# EAGLE design MultiBoard (EAGLE 9.2.2)
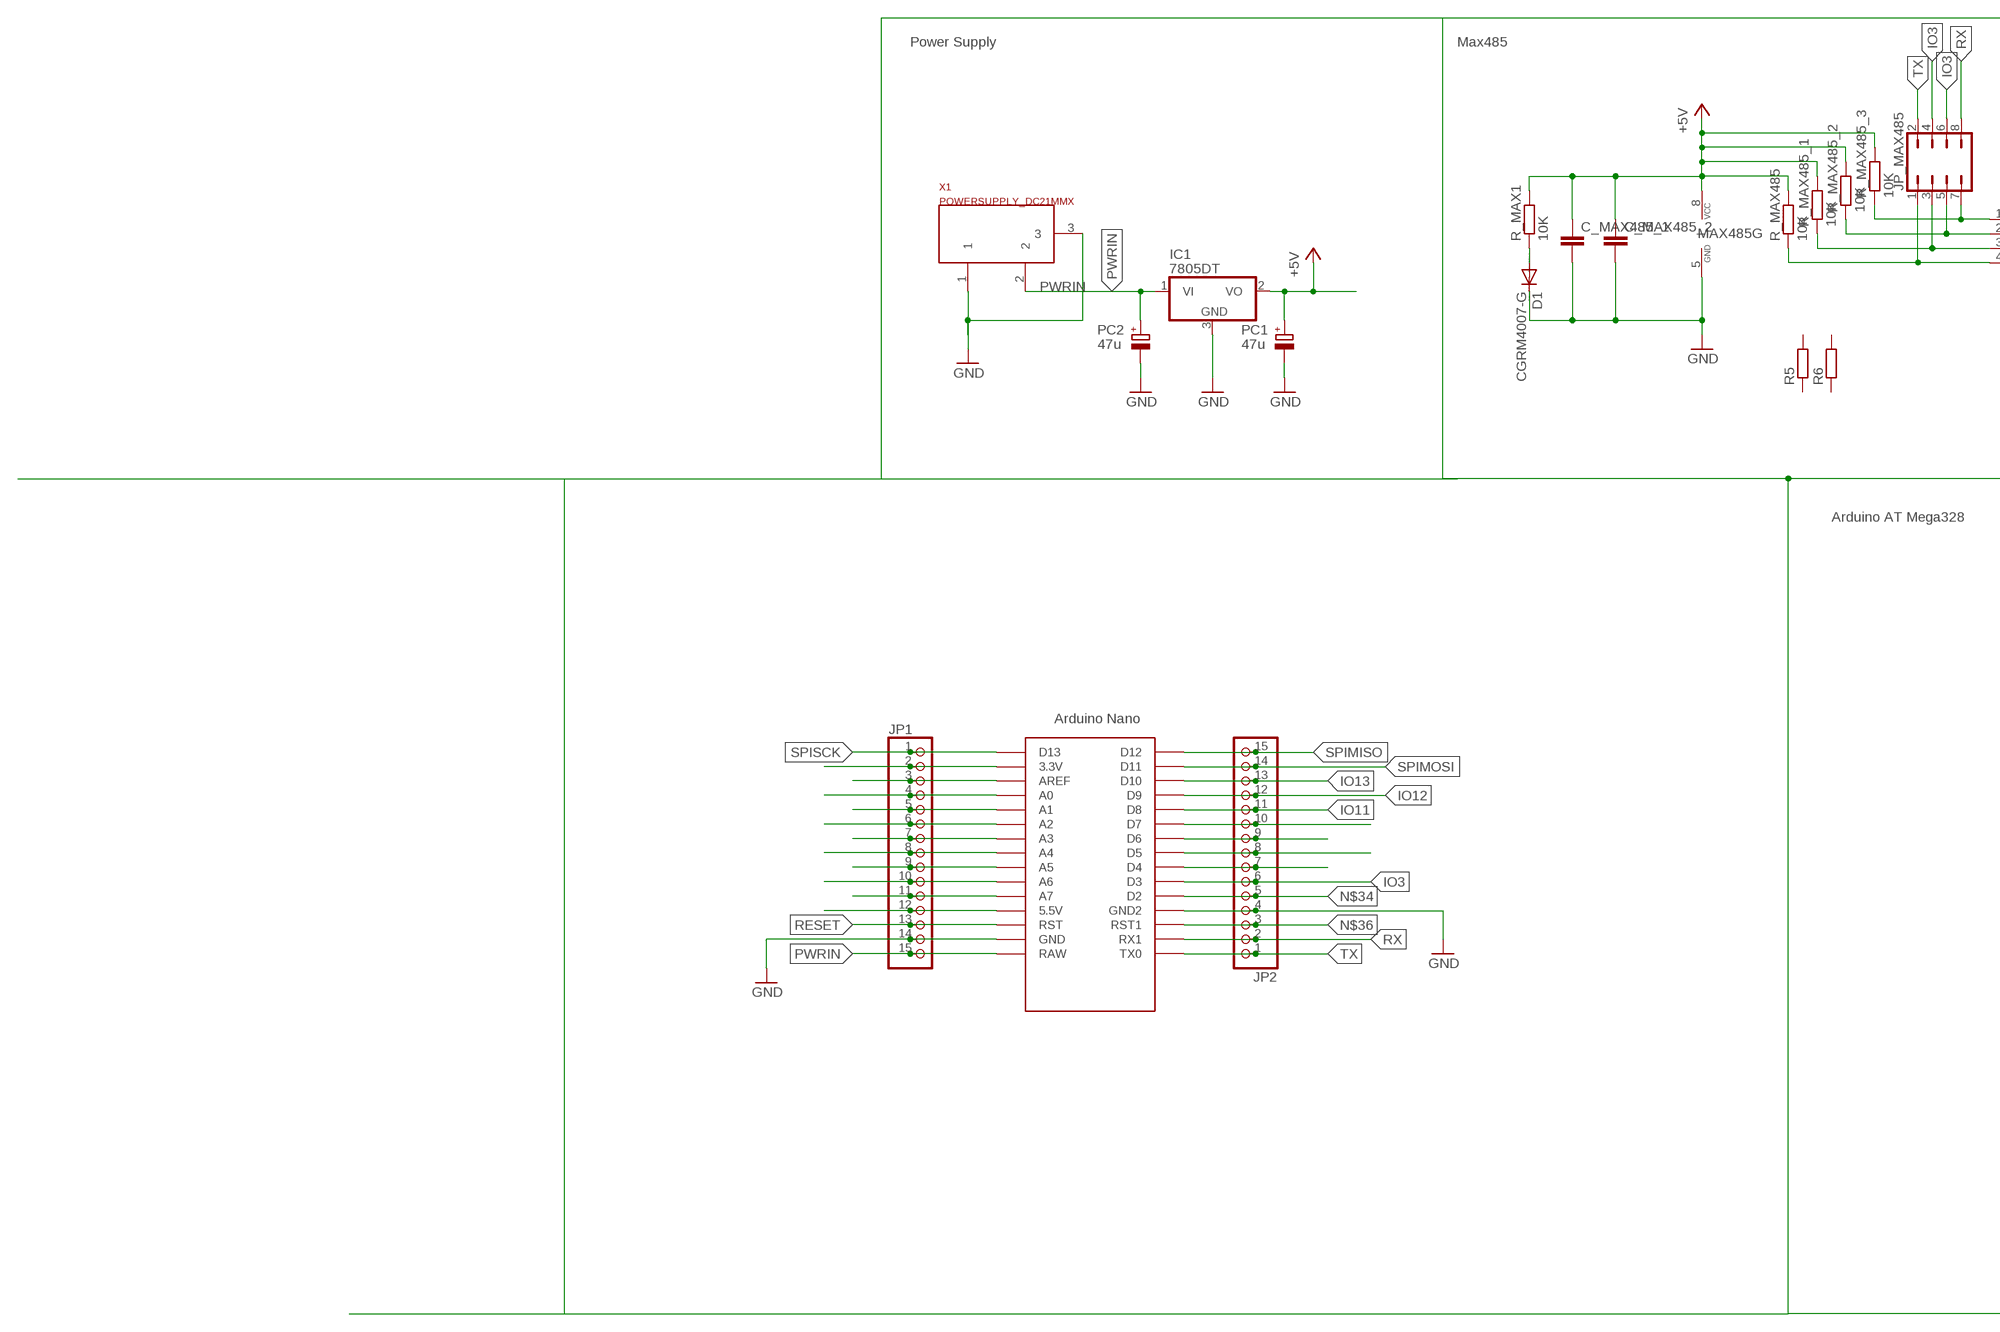
[diagram p0: schematic, sheet 1, part 1 of 2]
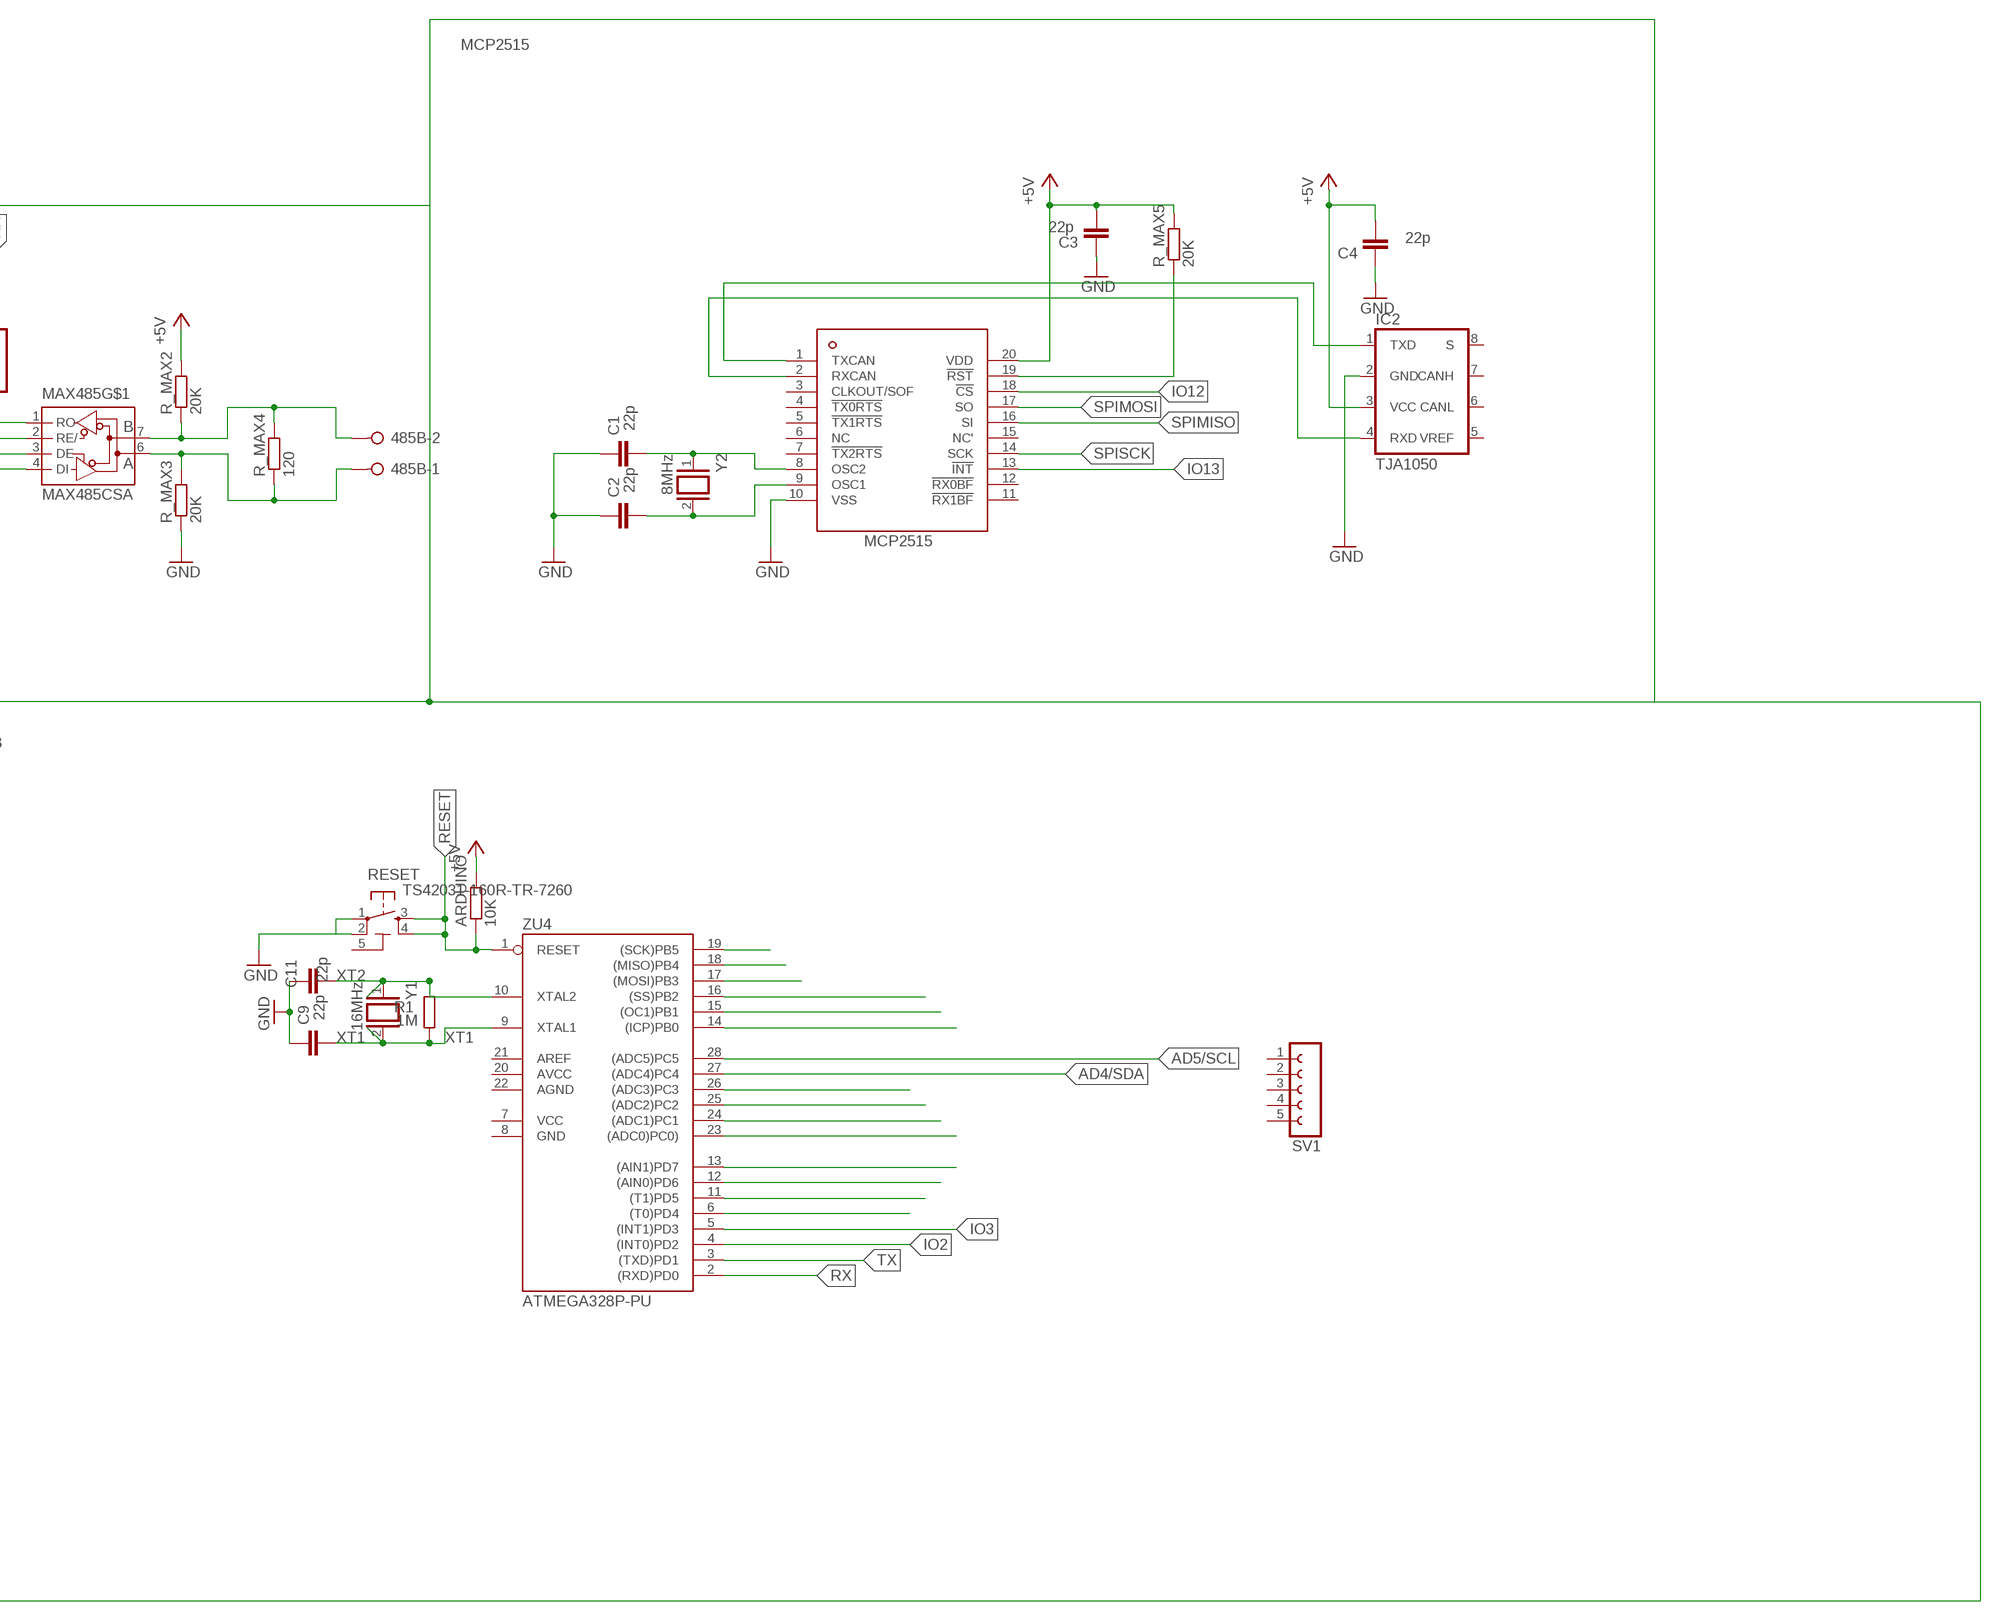
[diagram p1: schematic, sheet 1, part 2 of 2]

## Parts
485B  W237-02P  [W237-132]
ARDUINO  10K  R-EU_R0402  [R0402]
C1  22p  C-EU0603-RND  [C0603-ROUND]
C2  22p  C-EU0603-RND  [C0603-ROUND]
C3  22p  C-EU0603-RND  [C0603-ROUND]
C4  22p  C-EU0603-RND  [C0603-ROUND]
C9  22p  C-EU0603-RND  [C0603-ROUND]
C11  22p  C-EU0603-RND  [C0603-ROUND]
C_MAX485_1  C-EUC0402  [C0402]
C_MAX485_2  C-EUC0402  [C0402]
D1  CGRM4007-G  [SOD-123_MINI-SMA]
IC1  7805DT  [TO252]
IC2  TJA1050  [DIL08]
JP1  PINHD-1X15  [1X15]
JP2  PINHD-1X15  [1X15]
JP_MAX485  JP4Q  [JP4Q]
MAX485  MAX485CSA  [SO08]
PC1  47u  CPOL-EUD  [PANASONIC_D]
PC2  47u  CPOL-EUD  [PANASONIC_D]
R1  1M  R-EU_R0603  [R0603-ROUND]
R5  R-EU_M0805  [M0805]
R6  R-EU_M0805  [M0805]
R_MAX1  10K  R-EU_R0402  [R0402]
R_MAX2  20K  R-EU_R0402  [R0402]
R_MAX3  20K  R-EU_R0402  [R0402]
R_MAX4  120  R-EU_R0402  [R0402]
R_MAX5  20K  R-EU_R0402  [R0402]
R_MAX485  10K  R-EU_R0402  [R0402]
R_MAX485_1  10K  R-EU_R0402  [R0402]
R_MAX485_2  10K  R-EU_R0402  [R0402]
R_MAX485_3  10K  R-EU_R0402  [R0402]
RESET  TS42031-160R-TR-7260  TS42  [TS42]
SV1  FE05-1  [FE05-1]
U$1  NANO  [NANO]
U$2  MCP2515  [TSSOP20]
X1  POWERSUPPLY_DC21MMX  [POWERSUPPLY_DC-21MM]
Y1  16MHz  XTAL/S  [QS]
Y2  8MHz  XTAL/S  [QS]
ZU4  ATMEGA328P-PU  [DIL28-3]

## Nets
+5V: ARDUINO.2 C3.1 C4.1 C_MAX485_1.1 C_MAX485_2.1 IC1.2(VO) IC2.3(VCC) MAX485.8(G:VCC) PC1.+ R_MAX1.2 R_MAX2.2 R_MAX5.2 R_MAX485.2 R_MAX485_1.2 R_MAX485_2.2 R_MAX485_3.2 U$2.20(VDD)
AD0: ZU4.23((ADC0)PC0))
AD1: ZU4.24((ADC1)PC1)
AD2: ZU4.25((ADC2)PC2)
AD3: ZU4.26((ADC3)PC3)
AD4/SDA: ZU4.27((ADC4)PC4)
AD5/SCL: ZU4.28((ADC5)PC5)
GND: C1.2 C2.2 C3.2 C4.2 C9.2 C11.2 C_MAX485_1.2 C_MAX485_2.2 D1.C IC1.3(GND) IC2.2(GND) JP1.14 JP2.4 MAX485.5(G:GND) PC1.- PC2.- R_MAX3.1 RESET.1 RESET.2 U$1.GND U$1.GND1(GND2) U$2.10(VSS) X1.1 X1.3
IO2: ZU4.4((INT0)PD2)
IO3: JP2.6 JP_MAX485.4 JP_MAX485.6 U$1.D3 ZU4.5((INT1)PD3)
IO4: ZU4.6((T0)PD4)
IO5: ZU4.11((T1)PD5)
IO6: ZU4.12((AIN0)PD6)
IO7: ZU4.13((AIN1)PD7)
IO8: ZU4.14((ICP)PB0)
IO9: ZU4.15((OC1)PB1)
IO11: JP2.11 U$1.D8
IO12: JP2.12 U$1.D9 U$2.18(!CS)
IO13: JP2.13 U$1.D10 U$2.13(!INT)
MISO: ZU4.18((MISO)PB4)
MOSI: ZU4.17((MOSI)PB3)
N$1: JP_MAX485.7 MAX485.1(RO) R_MAX485_3.1
N$2: JP_MAX485.5 MAX485.2(RE/) R_MAX485_2.1
N$3: JP_MAX485.3 MAX485.3(DE) R_MAX485_1.1
N$4: JP_MAX485.1 MAX485.4(DI) R_MAX485.1
N$5: 485B.2 MAX485.7(B) R_MAX2.1 R_MAX4.2
N$6: D1.A R_MAX1.1
N$7: 485B.1 MAX485.6(A) R_MAX3.2 R_MAX4.1
N$10: IC2.1(TXD) U$2.1(TXCAN)
N$11: JP1.2 U$1.3.3V
N$12: JP1.3 U$1.AREF
N$13: JP1.4 U$1.A0
N$14: JP1.5 U$1.A1
N$15: JP1.6 U$1.A2
N$16: JP1.7 U$1.A3
N$17: JP1.8 U$1.A4
N$18: JP1.9 U$1.A5
N$19: JP1.10 U$1.A6
N$20: JP1.11 U$1.A7
N$21: JP1.12 U$1.5V(5.5V)
N$22: IC2.4(RXD) U$2.2(RXCAN)
N$23: R_MAX5.1 U$2.19(!RST)
N$29: JP2.10 U$1.D7
N$30: JP2.9 U$1.D6
N$31: JP2.8 U$1.D5
N$32: JP2.7 U$1.D4
N$33: C1.1 U$2.8(OSC2) Y2.1
N$34: JP2.5 U$1.D2
N$36: JP2.3 U$1.RST1
N$37: C2.1 U$2.9(OSC1) Y2.2
PWRIN [power]: IC1.1(VI) JP1.15 PC2.+ U$1.RAW X1.2
RESET: ARDUINO.1 JP1.13 RESET.3 RESET.4 U$1.RST ZU4.1(RESET)
RX: JP2.2 JP_MAX485.8 U$1.RX1 ZU4.2((RXD)PD0)
SCK: ZU4.19((SCK)PB5)
SPIMISO: JP2.15 U$1.D12 U$2.16(SI)
SPIMOSI: JP2.14 U$1.D11 U$2.17(SO)
SPISCK: JP1.1 U$1.D13 U$2.14(SCK)
SS: ZU4.16((SS)PB2)
TX: JP2.1 JP_MAX485.2 U$1.TX0 ZU4.3((TXD)PD1)
XT1: C9.1 R1.1 Y1.2 ZU4.9(XTAL1)
XT2: C11.1 R1.2 Y1.1 ZU4.10(XTAL2)
Unconnected: IC2.5(VREF) IC2.6(CANL) IC2.7(CANH) IC2.8(S) R5.1 R5.2 R6.1 R6.2 SV1.1 SV1.2 SV1.3 SV1.4 SV1.5 U$1.ICSP1 U$1.ICSP2 U$1.ICSP3 U$1.ICSP4 U$1.ICSP5 U$1.ICSP6 U$2.3(CLKOUT/SOF) U$2.4(!TX0RTS) U$2.5(!TX1RTS) U$2.6(NC) U$2.7(!TX2RTS) U$2.11(!RX1BF) U$2.12(!RX0BF) U$2.15(NC') ZU4.21(AREF)

## Notes on the sheet
- MCP2515
- Power Supply | Max485
- Arduino AT Mega328

## Power pins joined to a net without a drawn wire
5-GND: RESET.5(5-GND)
AGND: ZU4.22(AGND)
AVCC: ZU4.20(AVCC)
GND: ZU4.8(GND)
VCC: ZU4.7(VCC)

## Library data of the parts
485B = con-wago-508:W237-02P: WAGO SREW CLAMP; OC_FARNELL: unknown; OC_NEWARK: unknown
ARDUINO R5 R6 R_MAX1-R_MAX5 R_MAX485 R_MAX485_1-R_MAX485_3 = rcl:R-EU_: RESISTOR, European symbol; SPICEPREFIX: R
C1-C4 C9 C11 = SmartPrj:C-EU: CAPACITOR, European symbol
C_MAX485_1 C_MAX485_2 = rcl:C-EU: CAPACITOR, European symbol; SPICEPREFIX: C
D1 = diode:CGRM400*-G: Molded plasitc,JEDEC SOD-123/Mini SMA Source: Comchip CGRM4001-G.pdf
IC1 = linear:78*: Positive VOLTAGE REGULATOR Source: http://cache.national.com/ds/LM/LM78L05.pdf http://www.fairchildsemi.com/ds/LM/LM7805.pdf
IC2 = Marco:TJA1050
JP1 JP2 = pinhead:PINHD-1X15: PIN HEADER
JP_MAX485 = jumper:JP4Q: JUMPER
MAX485 = andereBauteile:MAX485: MAX485 RS485 Half Duplex Driver
PC1 PC2 = rcl:CPOL-EU: POLARIZED CAPACITOR, European symbol
R1 = SmartPrj:R-EU_: RESISTOR, European symbol
RESET = SmartPrj:TS42: TS42 Dongnan Electronics Tact switch VDC 12V - 50mA
SV1 = con-lsta:FE05-1: FEMALE HEADER; OC_FARNELL: unknown; OC_NEWARK: unknown
U$1 = Arduino-clone:NANO: Arduino Nano
U$2 = mcp2515:MCP2515: Microchip Technology’s MCP2515 is a stand-alone Controller Area Network (CAN) controller that implements the CAN specification, version 2.0B. It is capable of transmitting and receiving both standard and extended data and remote frames. The MCP2515 has two acceptance masks and six acceptance filters that are used to filter out unwanted messages, thereby reducing the host MCUs overhead. The MCP2515 interfaces with microcontrollers (MCUs) via an industry standard Serial Peripheral Interface (SPI).
X1 = SmartPrj:POWERSUPPLY_DC21MM
Y1 Y2 = SmartPrj:XTAL/S: CRYSTAL
ZU4 = SmartPrj:ATMEGA328P-: MICROCONTROLLER 4 Kbytes FLASH 128 bytes SRAM 256 bytes EEPROM UART 6-channel 10 bit ADC

## Net classes
0 default: width 0.254 mm, clearance 0.254 mm
1 power: width 0.61 mm, drill 0.61 mm, clearance 0.254 mm
2 gnd: width 0.305 mm, drill 0.559 mm, clearance 0.254 mm
3 usbvcc: width 0.508 mm, drill 0.61 mm, clearance 0.254 mm
4 aref: width 0.406 mm, drill 0.61 mm, clearance 0.254 mm

## Board
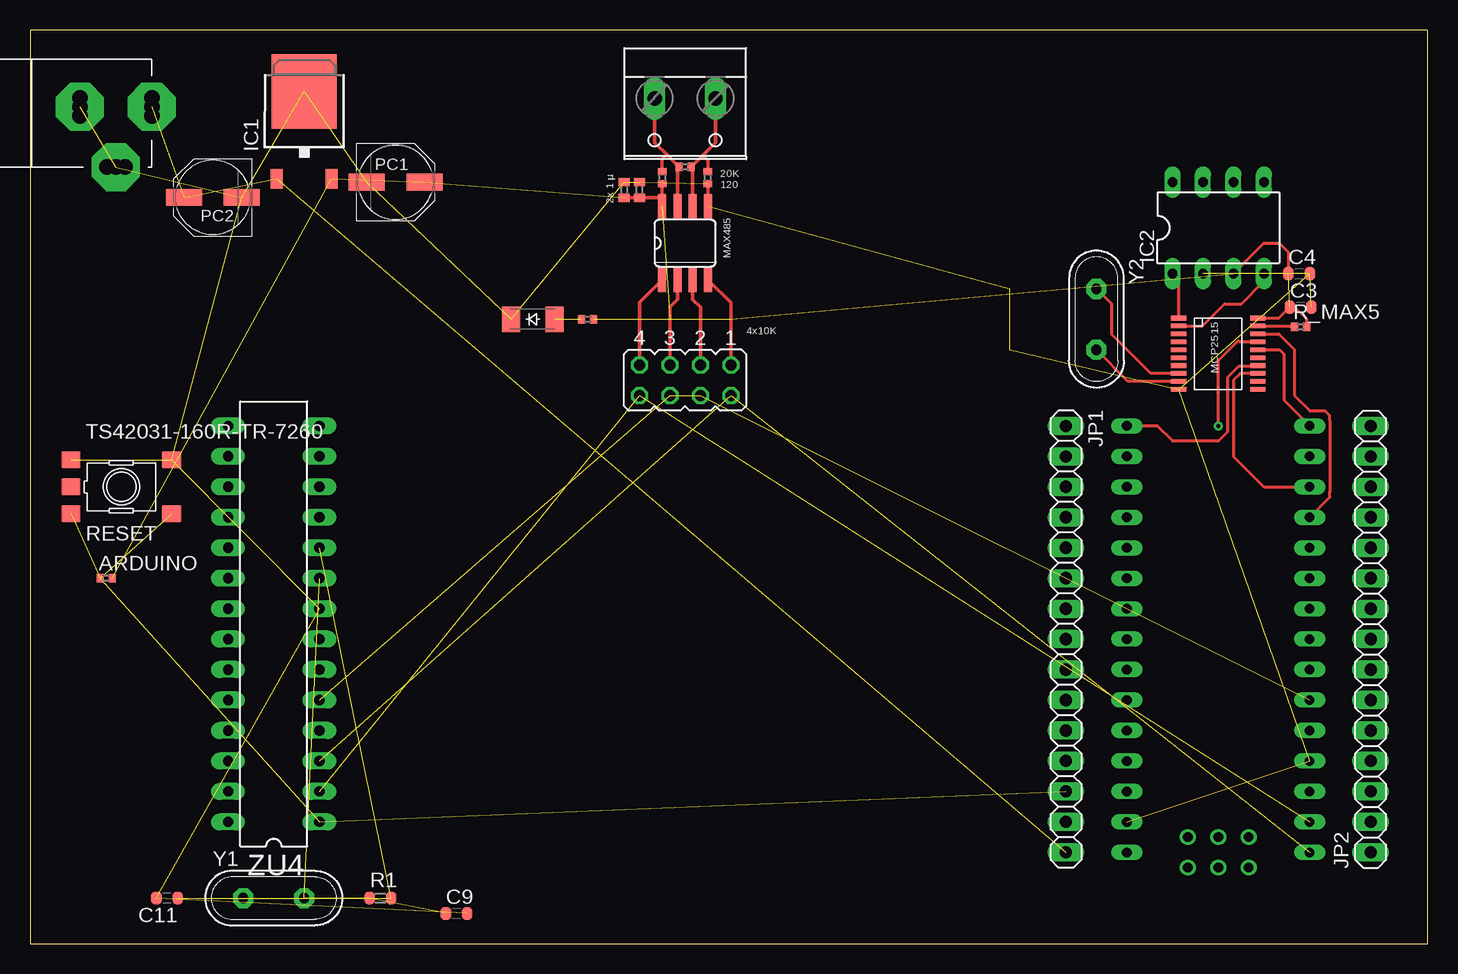
[diagram p2: board, top side]
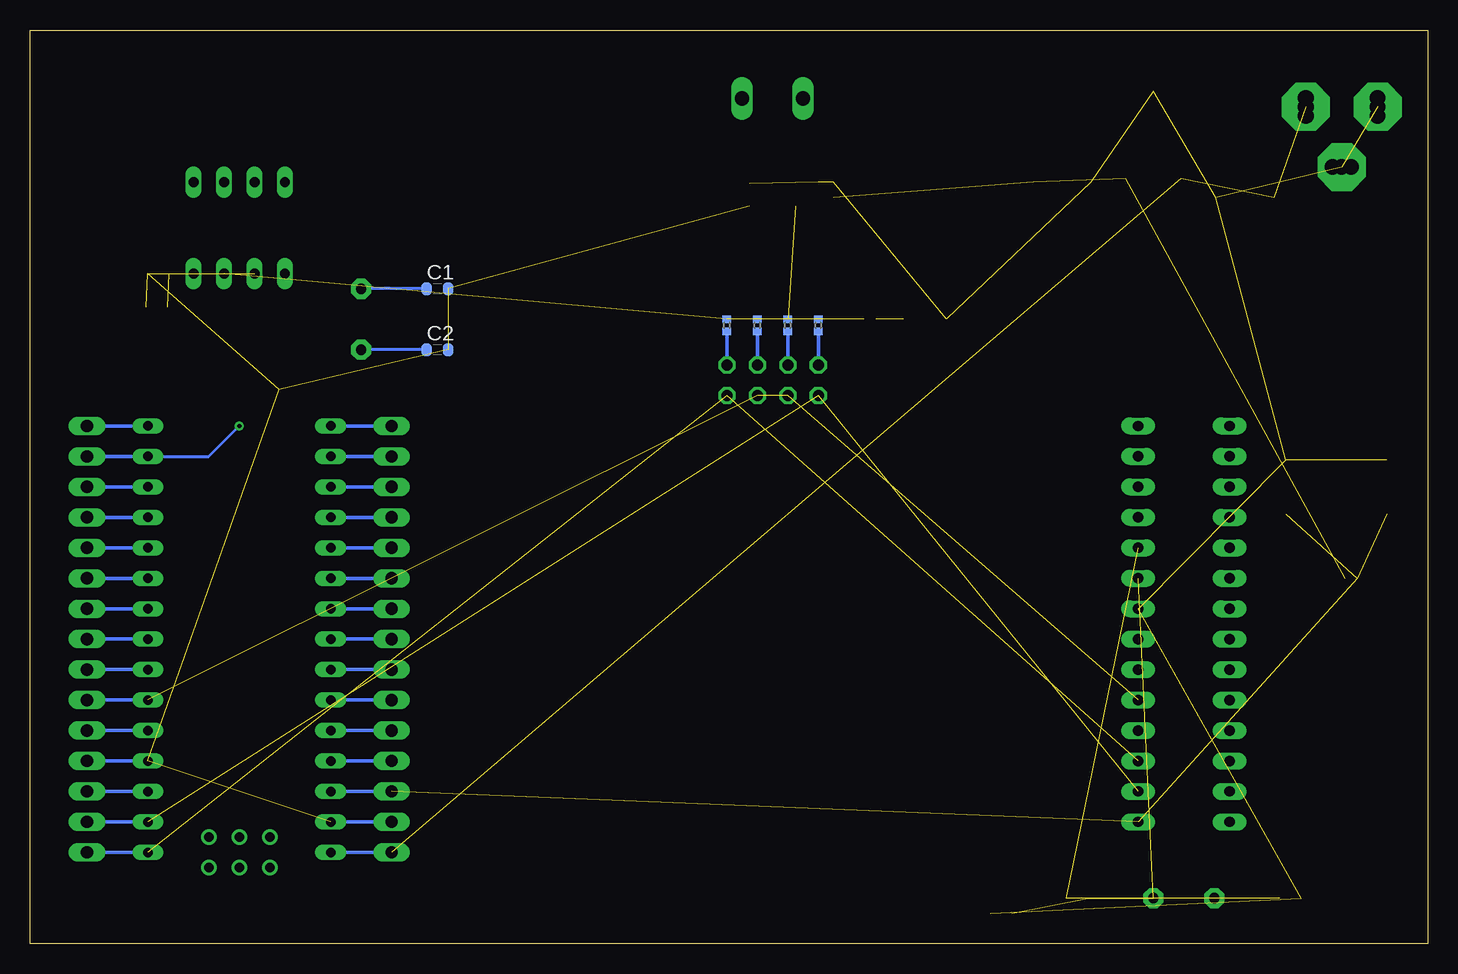
[diagram p3: board, bottom side, seen from below]

Size 116.51 x 76.19 mm. Coordinates in mm from the lower left corner, seen from the top.
Outline: 0,0 116.51,0 116.51,76.19 0,76.19 0,0
Copper layers (1*16): Top 0.035mm / dielectric 1.5mm / Bottom 0.035mm
Design rules "default": minimum track width 6mil, minimum drill 0.35mm, track to track 6mil, track to pad 6mil, pad to pad 6mil, via to via 6mil, smd to smd 6mil, copper to edge 40mil, drill to drill 6mil, minimum pad ring 10mil, minimum via ring 8mil, stop-mask expansion 4mil, vias tented up to drill 0mil, thermal gap 10mil

### Footprints (pad centres in the part's own frame; a part is rotated, then mirrored left to right if it is on the bottom)
W237-132 = drill 1.194 long: 1 -2.54,-0.635; 2 2.54,-0.635
R0402 = smd 0.6 x 0.7: 1 -0.5,0; 2 0.5,0
C0603-ROUND = smd 0.898 x 1.1: 1 -0.889,0; 2 0.889,0
C0402 = smd 0.7 x 0.9: 1 -0.65,0; 2 0.65,0
SOD-123_MINI-SMA = smd 1.5 x 2.1: A 1.8,0; C -1.8,0
TO252 = smd 1 x 1.6: 1 -2.28,-4.8; 2 2.28,-4.8 | smd 5.4 x 6.2: 3 0,2.5
DIL08 = drill 0.813 long: 1 -3.81,-3.81; 2 -1.27,-3.81; 3 1.27,-3.81; 4 3.81,-3.81; 5 3.81,3.81; 6 1.27,3.81; 7 -1.27,3.81; 8 -3.81,3.81
1X15 = drill 1.016 long: 1 -17.78,0; 2 -15.24,0; 3 -12.7,0; 4 -10.16,0; 5 -7.62,0; 6 -5.08,0; 7 -2.54,0; 8 0,0; 9 2.54,0; 10 5.08,0; 11 7.62,0; 12 10.16,0; 13 12.7,0; 14 15.24,0; 15 17.78,0
JP4Q = drill 0.914 octagon: 1 -3.81,-1.27; 2 -3.81,1.27; 3 -1.27,-1.27; 4 -1.27,1.27; 5 1.27,-1.27; 6 1.27,1.27; 7 3.81,-1.27; 8 3.81,1.27
SO08 = smd 0.66 x 2.032: 1 -1.905,-3.073; 2 -0.635,-3.073; 3 0.635,-3.073; 4 1.905,-3.073; 5 1.905,3.073; 6 0.635,3.073; 7 -0.635,3.073; 8 -1.905,3.073
PANASONIC_D = smd 3 x 1.4: + 2.4,0; - -2.4,0
R0603-ROUND = smd 0.898 x 1.1: 1 -0.889,0; 2 0.889,0
M0805 = smd 1.3 x 1.6: 1 -0.95,0; 2 0.95,0
TS42 = smd 1.6 x 1.4: 1 -4.2,2.25; 2 4.2,2.25; 3 -4.2,-2.25; 4 4.2,-2.25; 5 -4.2,0
FE05-1 = drill 0.813 long: 1 -5.08,0; 2 -2.54,0; 3 0,0; 4 2.54,0; 5 5.08,0
NANO = drill 0.8 long: 3.3V -10.16,24.13; 5V -10.16,-1.27; A0 -10.16,19.05; A1 -10.16,16.51; A2 -10.16,13.97; A3 -10.16,11.43; A4 -10.16,8.89; A5 -10.16,6.35; A6 -10.16,3.81; A7 -10.16,1.27; AREF -10.16,21.59; D2 5.08,1.27; D3 5.08,3.81; D4 5.08,6.35; D5 5.08,8.89; D6 5.08,11.43; D7 5.08,13.97; D8 5.08,16.51; D9 5.08,19.05; D10 5.08,21.59; D11 5.08,24.13; D12 5.08,26.67; D13 -10.16,26.67; GND -10.16,-6.35; GND1 5.08,-1.27; RAW -10.16,-8.89; RST -10.16,-3.81; RST1 5.08,-3.81; RX1 5.08,-6.35; TX0 5.08,-8.89 | drill 0.8: ICSP1 -5.08,-10.16; ICSP2 -5.08,-7.62; ICSP3 -2.54,-10.16; ICSP4 -2.54,-7.62; ICSP5 0,-10.16; ICSP6 0,-7.62
TSSOP20 = smd 1.27 x 0.381: 1 -3.302,2.642; 2 -3.302,1.981; 3 -3.302,1.321; 4 -3.302,0.66; 5 -3.302,0; 6 -3.302,-0.66; 7 -3.302,-1.321; 8 -3.302,-1.981; 9 -3.302,-2.642; 10 -3.302,-3.302; 11 3.302,-3.302; 12 3.302,-2.642; 13 3.302,-1.981; 14 3.302,-1.321; 15 3.302,-0.66; 16 3.302,0; 17 3.302,0.66; 18 3.302,1.321; 19 3.302,1.981; 20 3.302,2.642
POWERSUPPLY_DC-21MM = drill 1.3 pad 4 octagon: 1 -5.08,-3.353; 2 -0.076,-6.35; 3 -0.076,-0.356 | drill 1.3: 4 -5.08,-4.115; 5 -5.08,-2.591; 6 -0.838,-0.356; 7 0.686,-0.356; 8 -0.838,-6.35; 9 0.686,-6.35
QS = drill 0.85 pad 1.676 octagon: 1 -2.54,0; 2 2.54,0
DIL28-3 = drill 0.85 pad 1.422 long: 1 -16.51,-3.81; 2 -13.97,-3.81; 3 -11.43,-3.81; 4 -8.89,-3.81; 5 -6.35,-3.81; 6 -3.81,-3.81; 7 -1.27,-3.81; 8 1.27,-3.81; 9 3.81,-3.81; 10 6.35,-3.81; 11 8.89,-3.81; 12 11.43,-3.81; 13 13.97,-3.81; 14 16.51,-3.81; 15 16.51,3.81; 16 13.97,3.81; 17 11.43,3.81; 18 8.89,3.81; 19 6.35,3.81; 20 3.81,3.81; 21 1.27,3.81; 22 -1.27,3.81; 23 -3.81,3.81; 24 -6.35,3.81; 25 -8.89,3.81; 26 -11.43,3.81; 27 -13.97,3.81; 28 -16.51,3.81

### Placement (x,y rotation side)
485B  54.61,69.85 180 top
ARDUINO  6.35,30.48 0 top
C1  82.55,54.61 0 bottom
C2  82.55,49.53 0 bottom
C3  105.92,53.09 0 top
C4  105.79,55.88 0 top
C9  35.56,2.54 0 top
C11  11.43,3.81 180 top
C_MAX485_1  50.8,62.85 90 top
C_MAX485_2  49.53,62.85 90 top
D1  41.91,52.07 0 top
IC1  22.86,68.58 0 top
IC2  99.06,59.69 0 top
JP1  86.36,25.4 270 top
JP2  111.76,25.4 90 top
JP_MAX485  54.61,46.99 180 top
MAX485  54.61,58.42 0 top
PC1  30.48,63.5 0 top
PC2  15.24,62.23 180 top
R1  29.21,3.81 0 top
R5  -7.62,-41.91 0 top  (outside the outline)
R6  -7.62,-46.99 0 top  (outside the outline)
R_MAX1  46.49,52.07 0 top
R_MAX2  52.7,63.88 270 top
R_MAX3  56.52,63.88 90 top
R_MAX4  54.61,64.77 180 top
R_MAX5  105.92,51.44 0 top
R_MAX485  58.42,51.57 90 bottom
R_MAX485_1  55.88,51.57 90 bottom
R_MAX485_2  53.34,51.57 90 bottom
R_MAX485_3  50.8,51.57 90 bottom
RESET  7.62,38.1 0 top
SV1  8.89,-16.51 0 top  (outside the outline)
U$1  101.6,16.51 0 top
U$2  99.06,49.53 0 top
X1  3.81,69.85 90 top
Y1  20.32,3.81 0 top
Y2  88.9,52.07 270 top
ZU4  20.32,26.67 90 top

### Tracks (layer width: path | path; a pad name or v marks a point on that pad's centre or on a via)
+5V  (10 unrouted)
  Top 0.254: U$2.20 104.11,52.17 C3.1 105.41,53.09 106.42,52.08 R_MAX5.2 | IC2.3 102.87,58.42 104.14,58.42 104.9,57.66 C4.1
  Top 0.305: MAX485.8 52.7,62.23 | 52.7,62.23 R_MAX2.2 | 52.7,62.23 50.83,62.23 C_MAX485_1.1 C_MAX485_2.1
GND  (21 unrouted)
  Top 0.305: MAX485.5 R_MAX3.1
  Bottom 0.305: U$1.GND JP1.14 | U$1.GND1 JP2.4
IO3  (3 unrouted)
  Bottom 0.305: U$1.D3 JP2.6
IO11
  Bottom 0.305: U$1.D8 JP2.11
IO12
  Top 0.254: U$1.D9 108.37,37.25 108.33,37.29 108.33,37.63 108.37,37.67 108.37,43.61 108.33,43.65 108.33,44.07 107.95,44.45 106.68,44.45 105.41,45.72 105.41,49.53 104.09,50.85 U$2.18
  Bottom 0.305: U$1.D9 JP2.12
IO13
  Top 0.254: U$2.13 100.89,47.55 100.33,46.99 100.33,40.64 102.87,38.1 U$1.D10
  Bottom 0.305: U$1.D10 JP2.13
N$1
  Top 0.305: JP_MAX485.7 50.8,53.44 MAX485.1
  Bottom 0.305: JP_MAX485.7 R_MAX485_3.1
N$2
  Top 0.305: JP_MAX485.5 53.34,53.09 53.98,53.72 MAX485.2
  Bottom 0.305: JP_MAX485.5 R_MAX485_2.1
N$3
  Top 0.305: JP_MAX485.3 55.88,53.09 55.24,53.72 MAX485.3
  Bottom 0.305: JP_MAX485.3 R_MAX485_1.1
N$4
  Top 0.305: MAX485.4 58.42,53.44 JP_MAX485.1
  Bottom 0.305: JP_MAX485.1 R_MAX485.1
N$5
  Top 0.305: 53.09,65.79 R_MAX4.2 53.98,64.64 MAX485.7 | 53.09,65.79 52.07,66.81 485B.2 | R_MAX2.1 52.7,65.41 53.09,65.79
N$6  (1 unrouted)
N$7
  Top 0.305: 56.07,65.73 R_MAX4.1 55.24,64.64 MAX485.6 | 56.07,65.73 57.15,66.81 485B.1 | R_MAX3.2 56.52,65.28 56.07,65.73
N$10
  Top 0.254: U$2.1 95.76,55.37 IC2.1
N$11
  Bottom 0.305: U$1.3.3V JP1.2
N$12
  Bottom 0.305: U$1.AREF JP1.3
N$13
  Bottom 0.305: U$1.A0 JP1.4
N$14
  Bottom 0.305: U$1.A1 JP1.5
N$15
  Bottom 0.305: U$1.A2 JP1.6
N$16
  Bottom 0.305: U$1.A3 JP1.7
N$17
  Bottom 0.305: U$1.A4 JP1.8
N$18
  Bottom 0.305: U$1.A5 JP1.9
N$19
  Bottom 0.305: U$1.A6 JP1.10
N$20
  Bottom 0.305: U$1.A7 JP1.11
N$21
  Bottom 0.305: U$1.5V JP1.12
N$22
  Top 0.254: U$2.2 97.74,51.51 99.57,53.34 100.97,53.34 102.87,55.24 IC2.4
N$23
  Top 0.254: U$2.19 105.34,51.51 R_MAX5.1
N$29
  Bottom 0.305: U$1.D7 JP2.10
N$30
  Bottom 0.305: U$1.D6 JP2.9
N$31
  Bottom 0.305: U$1.D5 JP2.8
N$32
  Bottom 0.305: U$1.D4 JP2.7
N$33
  Top 0.254: U$2.8 93.42,47.55 90.17,50.8 90.17,53.34 Y2.1
  Bottom 0.254: C1.1 Y2.1
N$34
  Bottom 0.305: U$1.D2 JP2.5
N$36
  Bottom 0.305: U$1.RST1 JP2.3
N$37
  Top 0.254: U$2.9 91.54,46.89 Y2.2
  Bottom 0.254: C2.1 Y2.2
PWRIN  (3 unrouted)
  Bottom 0.305: U$1.RAW JP1.15
RESET  (4 unrouted)
  Bottom 0.305: U$1.RST JP1.13
RX  (2 unrouted)
  Bottom 0.305: U$1.RX1 JP2.2
SPIMISO
  Top 0.254: U$2.16 104.14,49.53 104.52,49.15 104.52,45.34 U$1.D12
  Bottom 0.305: U$1.D12 JP2.15
SPIMOSI  (via drill 0.35)
  Top 0.254: v99.06,43.18 99.06,48.64 100.71,50.29 100.81,50.19 U$2.17
  Bottom 0.254: U$1.D11 101.6,40.64 v99.06,43.18
  Bottom 0.305: U$1.D11 JP2.14
SPISCK
  Top 0.254: U$2.14 102.27,48.12 100.74,48.12 99.82,47.2 99.82,42.67 99.06,41.91 95.25,41.91 93.98,43.18 U$1.D13
  Bottom 0.305: U$1.D13 JP1.1
TX  (2 unrouted)
  Bottom 0.305: U$1.TX0 JP2.1
XT1  (3 unrouted)
XT2  (3 unrouted)

### Text on the board
tNames: 20K / 120 | 2x 1 µ | MAX485 | 4x10K